# Altium schematic sheet 电源.SchDoc
size A4
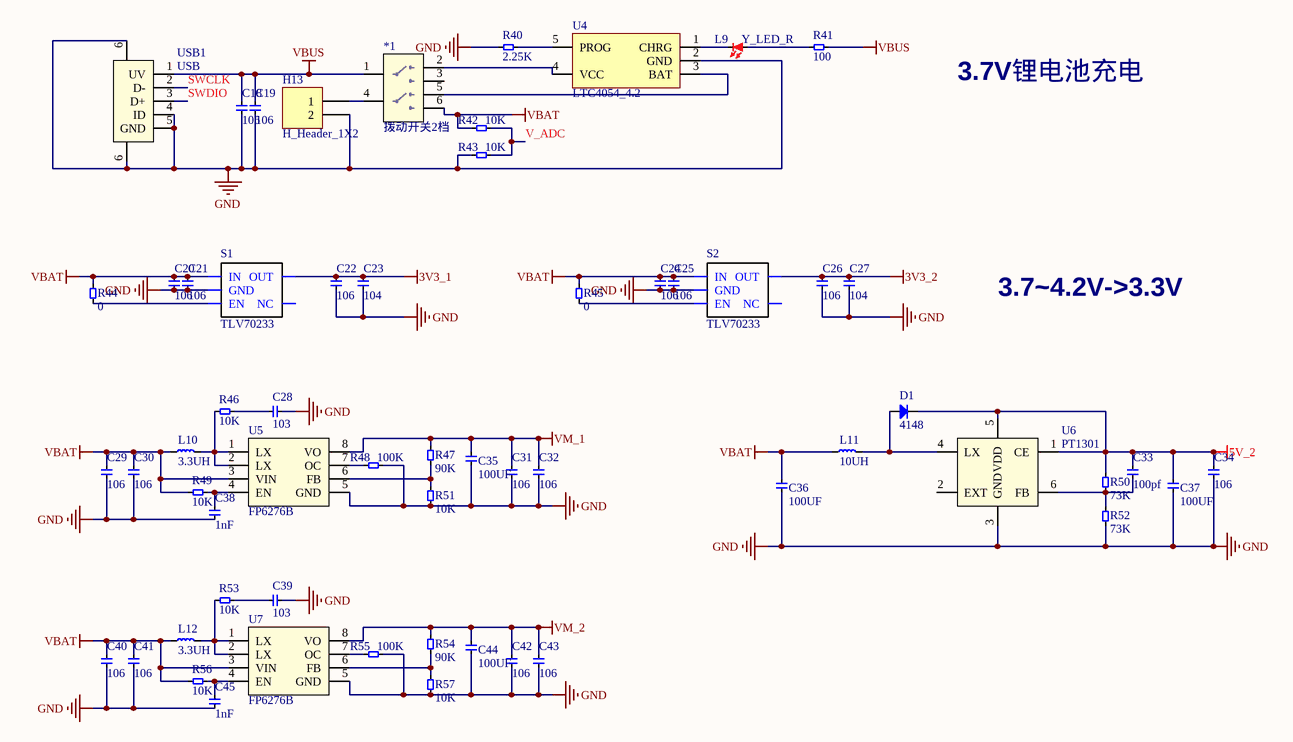
[diagram p0: 电源.SchDoc]

## Parts
*1  拨动开关2档  [拨档开关2x3立式]
C18  106  [C_0603]
C19  106  [C_0603]
C20  106  [C_0603]
C21  106  [C_0603]
C22  106  [C_0603]
C23  104  [C_0603]
C24  106  [C_0603]
C25  106  [C_0603]
C26  106  [C_0603]
C27  104  [C_0603]
C28  103  [C_0603]
C29  106  [C_0603]
C30  106  [C_0603]
C31  106  [C_0603]
C32  106  [C_0603]
C33  100pf  [C_0603]
C34  106  [C_0603]
C35  100UF  [C_1210]
C36  100UF  [C_1210]
C37  100UF  [C_1210]
C38  1nF  [C_0603]
C39  103  [C_0603]
C40  106  [C_0603]
C41  106  [C_0603]
C42  106  [C_0603]
C43  106  [C_0603]
C44  100UF  [C_1210]
C45  1nF  [C_0603]
D1  4148  [1206D]
H13  H_Header_1X2  [H_Header_1X2]
L9  Y_LED_R  [Y_LED_0805_R]
L10  3.3UH  [L_VISHAY_IHLP-1616]
L11  10UH  [L_VISHAY_IHLP-1616]
L12  3.3UH  [L_VISHAY_IHLP-1616]
R40  2.25K  [R_0603]
R41  100  [R_0603]
R42  10K  [R_0603]
R43  10K  [R_0603]
R44  0  [R_0603]
R45  0  [R_0603]
R46  10K  [R_0603]
R47  90K  [R_0603]
R48  100K  [R_0603]
R49  10K  [R_0603]
R50  73K  [R_0603]
R51  10K  [R_0603]
R52  73K  [R_0603]
R53  10K  [R_0603]
R54  90K  [R_0603]
R55  100K  [R_0603]
R56  10K  [R_0603]
R57  10K  [R_0603]
S1  TLV70233  [S_SOT23-5_TLV70233]
S2  TLV70233  [S_SOT23-5_TLV70233]
U4  LTC4054_4.2  [PDSO_G5]
U5  FP6276B  [SOP8]
U6  PT1301  [PDSO_G6]
U7  FP6276B  [SOP8]
USB1  USB  [micro-USB(立式直插）]

## Nets
3V3_1: C22.2 C23.2 S1.5(OUT)
3V3_2: C26.2 C27.2 S2.5(OUT)
5V_2: C33.2 C34.2 C37.2 D1.2(K) R50.2 U6.1(CE) U6.5(VDD)
GND: C18.1 C19.1 C20.1 C21.1 C22.1 C23.1 C24.1 C25.1 C26.1 C27.1 C28.2 C29.1 C30.1 C31.1 C32.1 C34.1 C35.1 C36.1 C37.1 C38.1 C39.2 C40.1 C41.1 C42.1 C43.1 C44.1 C45.1 H13.2 R40.1 R43.1 R48.2 R51.1 R52.1 R55.2 R57.1 S1.2(GND) S2.2(GND) U4.2(GND) U5.5(GND) U6.3(GND) U7.5(GND) USB1.4(ID) USB1.5(GND) USB1.6(G)
VBAT: *1.6 C20.2 C21.2 C24.2 C25.2 C29.2 C30.2 C36.2 C40.2 C41.2 L10.1 L11.1 L12.1 R42.1 R44.2 R45.2 R49.1 R56.1 S1.1(IN) S2.1(IN) U5.3(VIN) U7.3(VIN)
VBUS: *1.1 C18.2 C19.2 R41.2 USB1.1(UV)
VM_1: C31.2 C32.2 C35.2 R47.2 U5.8(VO)
VM_2: C42.2 C43.2 C44.2 R54.2 U7.8(VO)
SWCLK: USB1.2(D-)
SWDIO: USB1.3(D+)
V_ADC: R42.2 R43.2
Net*1_2: *1.2 U4.4(VCC)
Net*1_4: *1.4 H13.1
Net*1_5: *1.5 U4.3(BAT)
NetC28_1: C28.1 R46.2
NetC33_1: C33.1 R50.1 R52.2 U6.6(FB)
NetC38_2: C38.2 R49.2 U5.4(EN)
NetC39_1: C39.1 R53.2
NetC45_2: C45.2 R56.2 U7.4(EN)
NetD1_1: D1.1(A) L11.2 U6.4(LX)
NetL9_1: L9.1 R41.1
NetL9_2: L9.2 U4.1(CHRG)
NetL10_2: L10.2 R46.1 U5.1(LX) U5.2(LX)
NetL12_2: L12.2 R53.1 U7.1(LX) U7.2(LX)
NetR40_2: R40.2 U4.5(PROG)
NetR44_1: R44.1 S1.3(EN)
NetR45_1: R45.1 S2.3(EN)
NetR47_1: R47.1 R51.2 U5.6(FB)
NetR48_1: R48.1 U5.7(OC)
NetR54_1: R54.1 R57.2 U7.6(FB)
NetR55_1: R55.1 U7.7(OC)

Not connected (* = marked no-connect by the designer): *1 3; S1 4(NC); S2 4(NC); U6 2(EXT)

## Notes on the sheet
- 3.7V锂电池充电
- 3.7~4.2V->3.3V

## Library data of the parts
C18-C45 = C_无极贴片: 无极性贴片电容
D1 = diode 4148
H13 = H_Header_1X2: 单排2针排针; LatestRevisionDate: 17-Jul-2002; LatestRevisionNote: Re-released for DXP Platform.; Publisher: Altium Limited
L9 = Y_LED_R: 红色LED
L10-L12 = L_贴片功率: 贴片屏蔽式功率电感
R40-R57 = R_贴片: 贴片电阻
S1 S2 = S_TLV70233: 小封装LDO
U5 U7 = FP6267B